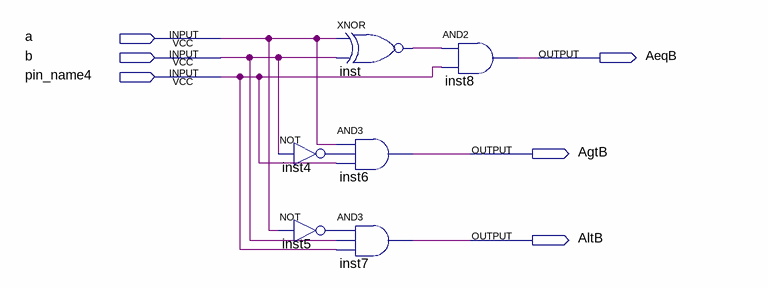
[diagram p0: schematic sheet]
// Quartus schematic Comparador1bit.bdf as structural Verilog: 6 symbols, 6 pins
module Comparador1bit (
  input  a,
  input  b,
  input  pin_name4,
  output AeqB,
  output AgtB,
  output AltB
);

  wire inst4_out, inst5_out, inst_out;

  not inst4 (inst4_out, b);
  not inst5 (inst5_out, a);
  xnor inst (inst_out, a, b);
  and inst6 (AgtB, a, inst4_out, pin_name4);
  and inst7 (AltB, inst5_out, b, pin_name4);
  and inst8 (AeqB, inst_out, pin_name4);
endmodule
